# EasyEDA Pro project EasyEDAProject.epro

# Schematic Schematic1
Board Name: Board1; Create Date: 2025-12-03; Page Name: P1; Project Name: Tressure; Schematic Name: Schematic1; Update Date: 2025-12-18; Company: EasyEDA.com; Page Size: A4; Version: V1.0
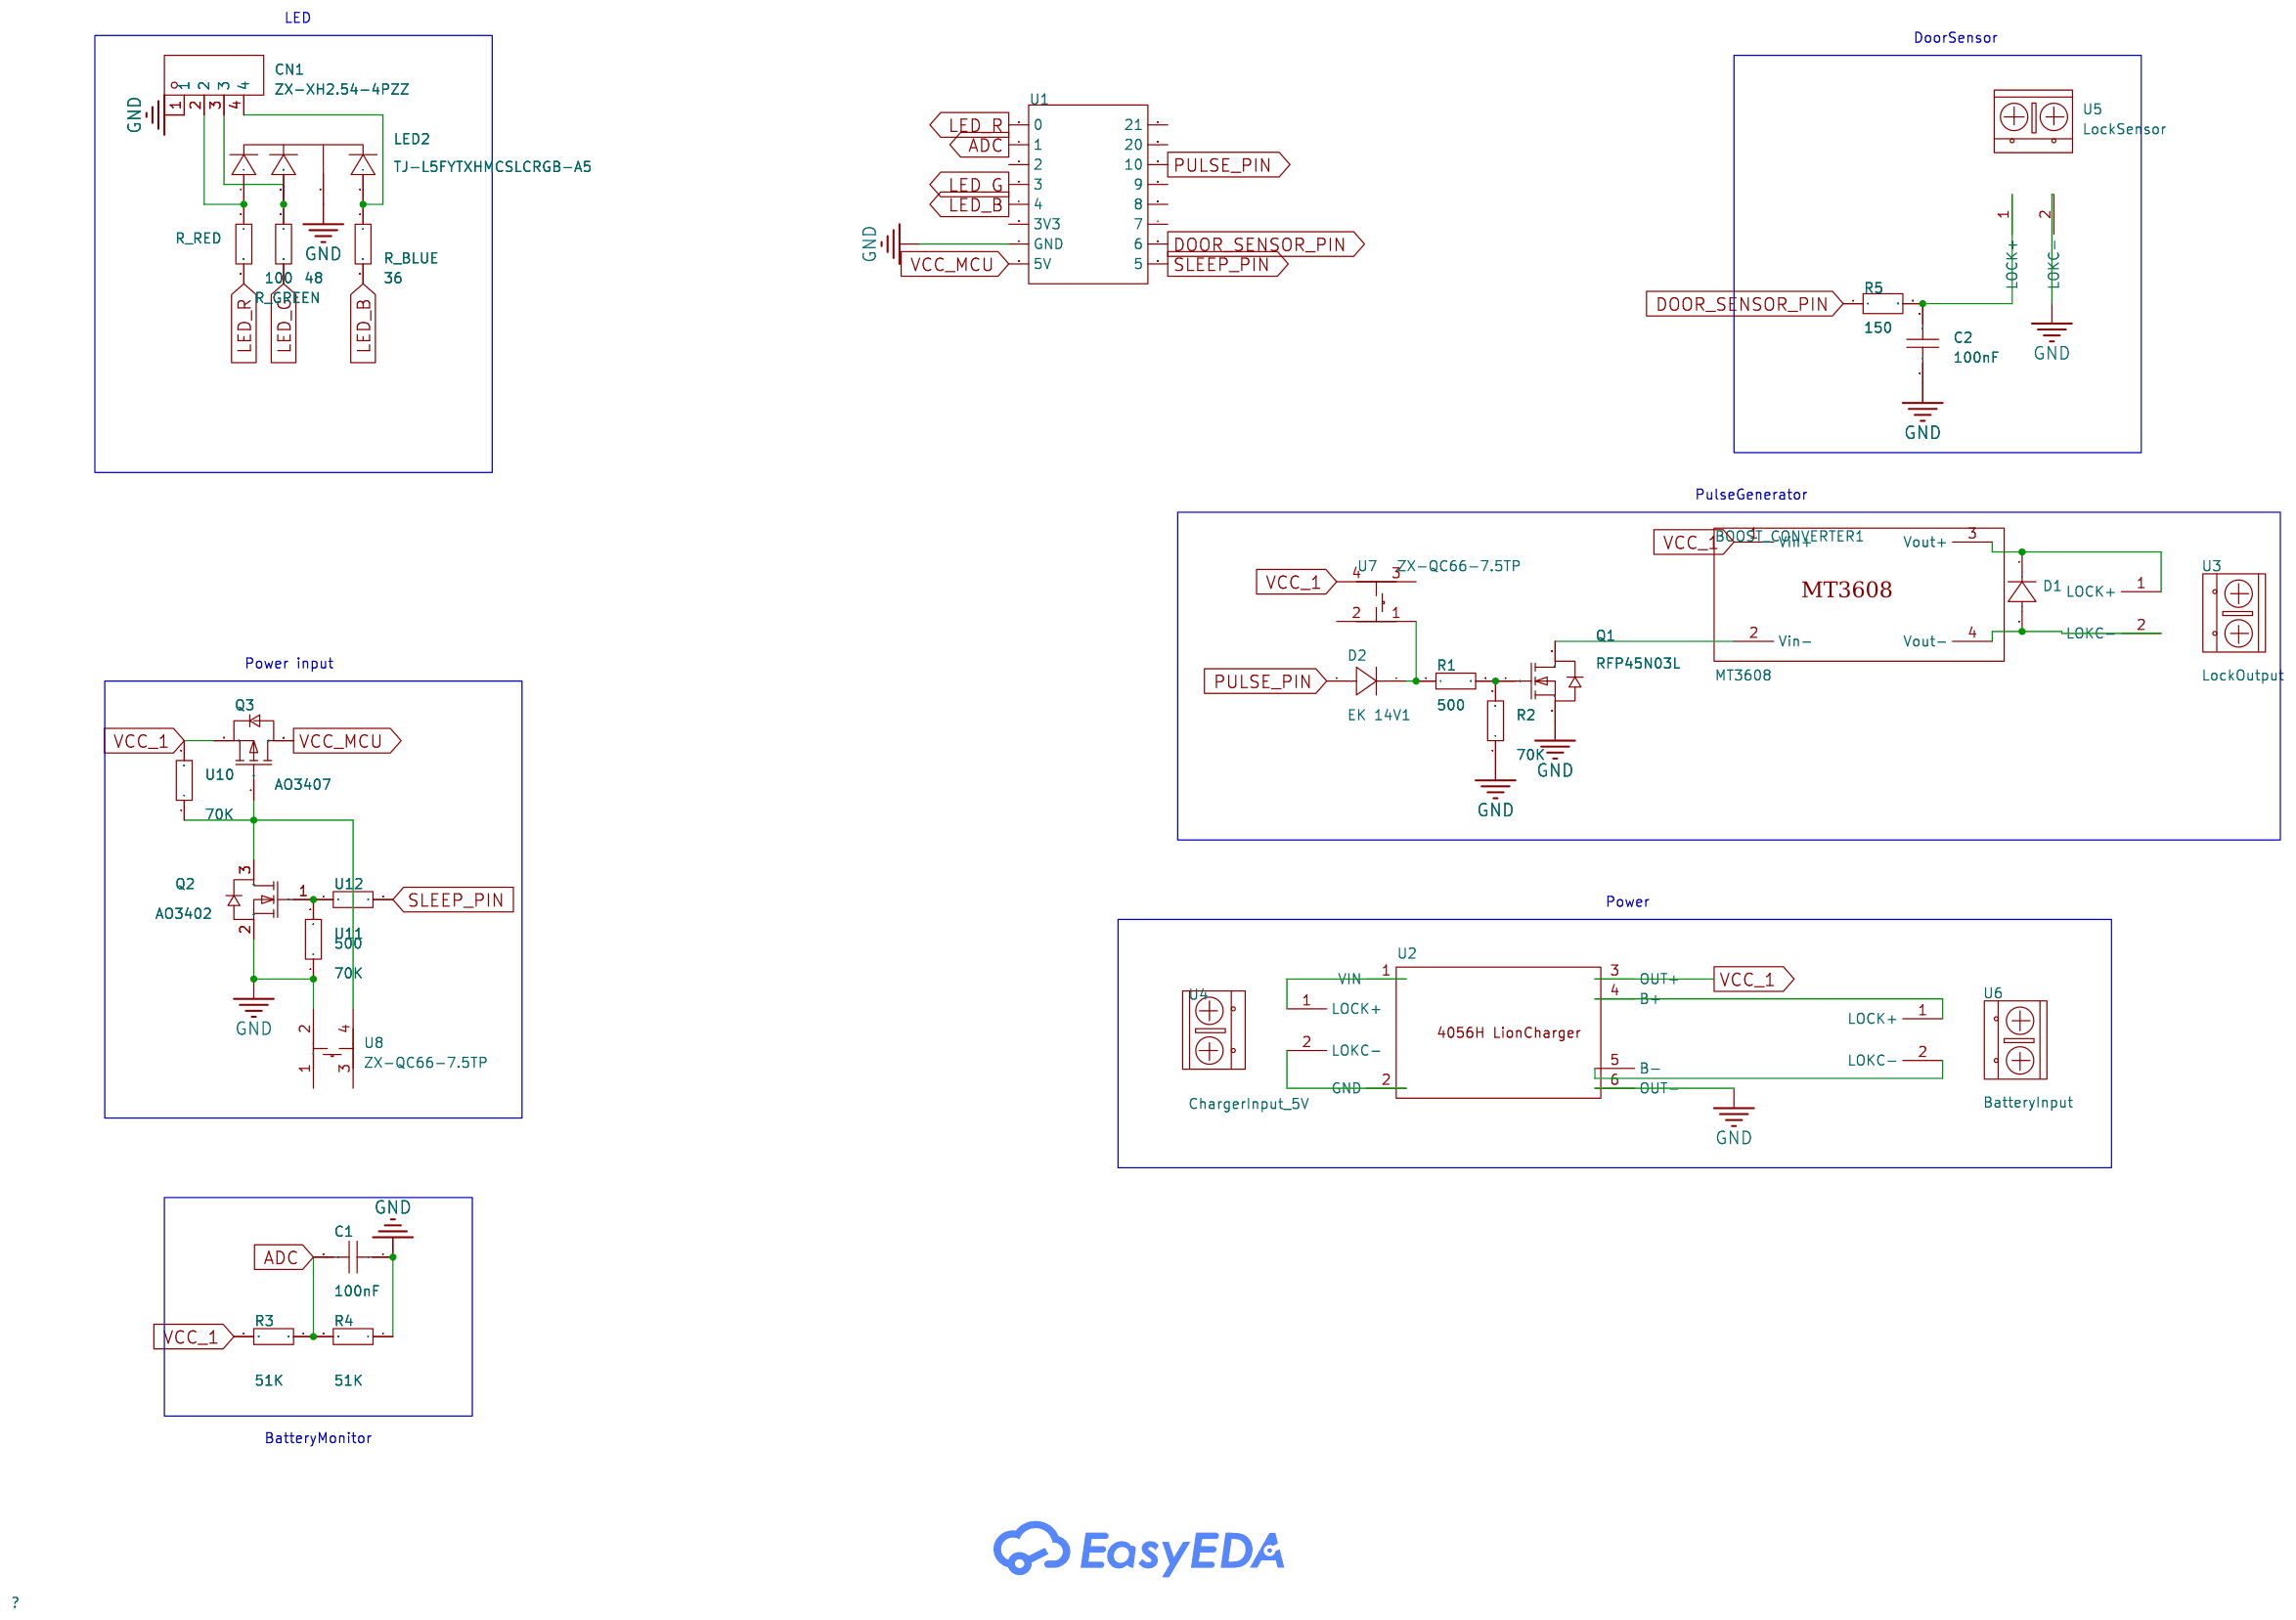
[diagram p0: schematic sheet]

## Parts
BOOST_CONVERTER1  MT3608  [MT3608 BOOST]
C1  100nF  [C0603]
C2  100nF  [CAP-TH_L5.0-W2.5-P5.00-D1.0]
CN1  ZX-XH2.54-4PZZ  [CONN-TH_4P-P2.50_4PIN]
D1  -  [SMA_L4.4-W2.8-LS5.4-RD]
D2  EK 14V1  [DIO-TH_BD2.7-L5.0-P10.00-D0.8]
LED2  TJ-L5FYTXHMCSLCRGB-A5  [LED-TH_4P-BD5.8-P1.30]
Q1  RFP45N03L  [TO-220-3_L9.9-W4.5-P2.54-L]
Q2  AO3402  [SOT-23_L2.9-W1.3-P1.90-LS2.4-BR]
Q3  AO3407  [SOT-23-3_L2.9-W1.3-P1.90-LS2.4-BR]
R1  500  [RES-TH_BD2.3-L6.5-P10.50-D0.5]
R2  70K  [RES-TH_BD2.3-L6.5-P10.50-D0.5]
R3  51K  [RES-TH_BD2.3-L6.5-P10.50-D0.5]
R4  51K  [RES-TH_BD2.3-L6.5-P10.50-D0.5]
R5  150  [RES-TH_BD2.3-L6.5-P10.50-D0.5]
R_BLUE  36  [RES-TH_BD2.3-L6.5-P10.50-D0.5]
R_GREEN  48  [RES-TH_BD2.3-L6.5-P10.50-D0.5]
R_RED  100  [RES-TH_BD2.3-L6.5-P10.50-D0.5]
U1  -  [ESP32-C3 SuperMini]
U2  -  [LionCharger]
U3  LockOutput  [TerminalBlock:TerminalBlock_bornier-2_P5.08mm]
U4  ChargerInput_5V  [TerminalBlock:TerminalBlock_bornier-2_P5.08mm]
U5  LockSensor  [TerminalBlock:TerminalBlock_bornier-2_P5.08mm]
U6  BatteryInput  [TerminalBlock:TerminalBlock_bornier-2_P5.08mm]
U7  ZX-QC66-7.5TP  [KEY-SMD_4P-L6.0-W6.0-P4.50-LS8.6]
U8  ZX-QC66-7.5TP  [KEY-SMD_4P-L6.0-W6.0-P4.50-LS8.6]
U10  70K  [RES-TH_BD2.3-L6.5-P10.50-D0.5]
U11  70K  [RES-TH_BD2.3-L6.5-P10.50-D0.5]
U12  500  [RES-TH_BD2.3-L6.5-P10.50-D0.5]

## Library data of the parts
BOOST_CONVERTER1 = MT3608
C1 = CAP_0603: Supplier Footprint: 0603
C2 = CC1H104MC1FD3F6C10MF: Capacitance:100nF Tolerance:±20% Tolerance:±20% Voltage Rating:50V Pin Spacing:5.08mm Temperature Coefficient:Y5V Diameter:6mm Body Thickness:2.2mm; LCSC Part Name: 100nF ±20% 50V; Supplier Part: C254085; Manufacturer: Dersonic(德尔创); Supplier Footprint: 插件,P=5.08mm; JLCPCB Part Class: Extended Part; Datasheet: https://item.szlcsc.com/datasheet/CC1H104MC1FD3F6C10MF/248635.html; Supplier: LCSC; Tolerance: ±20%; Voltage Rating: 50V; Pin Spacing: 5.08mm; Temperature Coefficient: Y5V; Diameter: 6mm; Body Thickness: 2.2mm
CN1 = ZX-XH2.54-4PZZ: Pins Structure:1x4P Pitch:2.5mm Mounting Type:Through Hole Reference Series:XH Number of Pins:4P Number of Rows:1 Number of PINs Per Row:4 Row Spacing:- Current Rating:3A Contact Material:Brass Contact Plating:Tin Operating Temperature:-25℃~+85℃ Operating; LCSC Part Name: 1x4P 间距:2.5mm 直插 系列:XH; Supplier Part: C7429634; Manufacturer: Megastar(兆星); Supplier Footprint: 插件,P=2.5mm; JLCPCB Part Class: Extended Part; Datasheet: https://item.szlcsc.com/datasheet/ZX-XH2.54-4PZZ/8427551.html; Supplier: LCSC; Pins Structure: 1x4P; Pitch: 2.5mm; Mounting Type: Through Hole; Reference Series: XH; Number of Pins: 4P; Number of Rows: 1; Number of PINs Per Row: 4; Current Rating: 3A; Contact Material: Brass; Contact Plating: Tin; Operating Temperature: -25℃~+85℃; Voltage Rating: 250V; Plastic Material: PA66; Flame Retardant Rating: UL94V-0; Color: White; Z-Height of the Board: 7mm; X-Length of Bottom Edge on Board (Spacing Line): 12.5mm; Y-Width of Bottom Edge on Board: 5.9mm
D1 = 1N4007: Supplier Footprint: SMA(DO-214AC); Supplier Part: C727081; JLCPCB Part Class: Extended Part
D2 = EK 14V1: Supplier Part: C19619582; Manufacturer: SANKEN(三垦); Supplier Footprint: 插件; JLCPCB Part Class: Extended Part; Datasheet: https://atta.szlcsc.com/upload/public/pdf/source/20231227/0C1AC18B852B4BA9064905ABC13E61C2.pdf; Supplier: LCSC
LED2 = TJ-L5FYTXHMCSLCRGB-A5: Diode Configuration:Common Cathode Luminous Intensity:R:100mcd~200mcd；B:100mcd~200mcd；G:800mcd~1200mcd Forward Voltage(Vf):R:1.8V~2.4V；B:2.8V~3.4V；G:2.8V~3.4V Operating Temperature:-20℃~+80℃ Operating Temperature:-20℃~+80℃; LCSC Part Name: RGB三色; Supplier Part: C330759; Manufacturer: TOGIALED(统佳); Supplier Footprint: 插件,D=5mm; JLCPCB Part Class: Extended Part; Datasheet: https://item.szlcsc.com/datasheet/TJ-L5FYTXHMCSLCRGB-A5/310372.html; Supplier: LCSC; Diode Configuration: Common Cathode; Luminous Intensity: R:100mcd~200mcd；B:100mcd~200mcd；G:800mcd~1200mcd; Forward Voltage(Vf): R:1.8V~2.4V；B:2.8V~3.4V；G:2.8V~3.4V; Operating Temperature: -20℃~+80℃
Q1 = RFP45N03L: Type:1 N-channel Drain Source Voltage (Vdss): Continuous Drain Current (Id):- Drain Source On Resistance (RDS(on)@Vgs,Id):22mΩ Power Dissipation (Pd): Gate Threshold Voltage (Vgs(th)@Id):2V@250uA Total Gate Charge (Qg@Vgs):60nC@10V Input Capacitance (Ciss; LCSC Part Name: 1个N沟道 耐压:30V 电流:45A; Supplier Part: C3290321; Manufacturer: HARRIS(哈利斯); Supplier Footprint: TO-220-3; JLCPCB Part Class: Extended Part; Datasheet: https://atta.szlcsc.com/upload/public/pdf/source/20240403/41EFF8D01A5A2EBD92568F0B79DD2BA2.pdf; Supplier: LCSC; Type: 1 N-channel; Drain Source On Resistance (RDS(on)@Vgs,Id): 22mΩ; Gate Threshold Voltage (Vgs(th)@Id): 2V@250uA; Total Gate Charge (Qg@Vgs): 60nC@10V; Input Capacitance (Ciss@Vds): 1.65nF@25V; Reverse Transfer Capacitance (Crss@Vds): 200pF@25V; Operating Temperature: -55℃~+175℃@(Tj)
Q2 = AO3402_C2938369: Number:1 N-Channel Drain to Source Voltage:30V Current - Continuous Drain(Id):4A RDS(on):55mΩ@10V Pd - Power Dissipation:1.2W Gate Threshold Voltage (Vgs(th)):1.4V@250uA Gate Charge(Qg):4.34nC@4.5V Input Capacitance(Ciss):390pF Reverse Transfer Capacitanc; LCSC Part Name: 1个N沟道 耐压:30V 电流:4A; Supplier Part: C2938369; Manufacturer: GOODWORK(固得沃克); Supplier Footprint: SOT-23; JLCPCB Part Class: Extended Part; Datasheet: https://item.szlcsc.com/datasheet/AO3402/3294706.html; Supplier: LCSC; Number: 1 N-Channel; Drain to Source Voltage: 30V; Current - Continuous Drain(Id): 4A; RDS(on): 55mΩ@10V; Pd - Power Dissipation: 1.2W; Gate Threshold Voltage (Vgs(th)): 1.4V@250uA; Gate Charge(Qg): 4.34nC@4.5V; Input Capacitance(Ciss): 390pF; Reverse Transfer Capacitance (Crss@Vds): 41pF; Operating Temperature: -55℃~+150℃; Type: N-Channel; Output Capacitance(Coss): 54.5pF
Q3 = AO3407_C6562206: Number:1 P-Channel Drain to Source Voltage:30V Current - Continuous Drain(Id):3.5A RDS(on):87mΩ@4.5V Pd - Power Dissipation:350mW Gate Threshold Voltage (Vgs(th)):1.5V Gate Charge(Qg):- Input Capacitance(Ciss):565pF@0V Reverse Transfer Capacitance (Crss@V; LCSC Part Name: P沟道增强型MOSFET 1个P沟道 耐压:30V 电流:3.5A; Supplier Part: C6562206; Manufacturer: YONGYUTAI(永裕泰); Supplier Footprint: SOT-23; JLCPCB Part Class: Extended Part; Datasheet: https://item.szlcsc.com/datasheet/AO3407/7516174.html; Supplier: LCSC; Number: 1 P-Channel; Drain to Source Voltage: 30V; Current - Continuous Drain(Id): 3.5A; RDS(on): 87mΩ@4.5V; Pd - Power Dissipation: 350mW; Gate Threshold Voltage (Vgs(th)): 1.5V; Input Capacitance(Ciss): 565pF@0V; Reverse Transfer Capacitance (Crss@Vds): 77pF; Operating Temperature: -55℃~+150℃; Type: P-Channel; Output Capacitance(Coss): 89pF
R1-R4 R_BLUE R_GREEN R_RED U10-U12 = Res_0603: Supplier Footprint: 0603
R5 = MF1/4W-1KΩ±1%T52: Type:Metal Film Resistors Resistance: Tolerance:±1% Tolerance:±1% Power(Watts):250mW Temperature Coefficient:±200ppm/℃ Temperature Coefficient:±200ppm/℃; LCSC Part Name: 金属膜电阻 1kΩ ±1% 250mW; Supplier Part: C713997; Manufacturer: 华星机电; Supplier Footprint: 插件,D2.3xL6.5mm; JLCPCB Part Class: Extended Part; Datasheet: https://atta.szlcsc.com/upload/public/pdf/source/20200731/C713882_AE8EB1102749D7E4FB4FB13DC898C429.pdf; Supplier: LCSC; Type: Metal Film Resistors; Tolerance: ±1%; Power(Watts): 250mW; Temperature Coefficient: ±200ppm/℃
U1 = ESP32-C3 SuperMini
U2 = Lio-Charger
U3-U6 = TerminalBlock:TerminalBlock_bornier-2_P5.08mm
U7 U8 = ZX-QC66-7.5TP: Circuit:SPST Actuator Style:Round Button Operating Force:2.6N Mounting Type:Surface Mount,Vertical Length:6mm Width:6mm Switch Height:7.5mm with Bracket:Without Bracket Contact Current:50mA Voltage Rating:12V Actuator/Cap Color:Black Termination Style:Gul; LCSC Part Name: 6*6*7.5贴片; Supplier Part: C7470157; Manufacturer: Megastar(兆星); Supplier Footprint: SMD-4P,6x6mm; JLCPCB Part Class: Extended Part; Datasheet: https://item.szlcsc.com/datasheet/ZX-QC66-7.5TP/8519163.html; Supplier: LCSC; Circuit: SPST; Actuator Style: Round Button; Operating Force: 2.6N; Mounting Type: Surface Mount,Vertical; Length: 6mm; Width: 6mm; Switch Height: 7.5mm; with Bracket: Without Bracket; Contact Current: 50mA; Voltage Rating: 12V; Actuator/Cap Color: Black; Termination Style: Gull Wing; Life: 100,000 Cycles; Operating Temperature: -30℃~+80℃

## Nets
GND: C1.1 C2.1 CN1.1 LED2.2(-) Q1.3(S) Q2.2(S) R2.1 R4.1 U1.14(GND) U2.6(OUT-) U5.2(LOKC-) U8.2 U11.1
VCC_1: BOOST_CONVERTER1.1(Vin+) Q3.2(S) R3.2 U2.3(OUT+) U7.4 U10.2
VCC_MCU: Q3.3(D) U1.15(5V)
ADC: C1.2 R3.1 R4.2 U1.1
DOOR_SENSOR_PIN: R5.1 U1.6
LED_B: R_BLUE.2 U1.4
LED_G: R_GREEN.2 U1.3
LED_R: R_RED.2 U1.0
PULSE_PIN: D2.2(A) U1.10
SLEEP_PIN: U1.5 U12.2
$1N1444: BOOST_CONVERTER1.3(Vout+) D1.1(K) U3.1(LOCK+)
$1N1449: BOOST_CONVERTER1.4(Vout-) D1.2(A) U3.2(LOKC-)
$1N1690: Q1.1(G) R1.2 R2.2
$1N2096: U2.1(VIN) U4.1(LOCK+)
$1N2102: U2.2(GND) U4.2(LOKC-)
$1N2853: CN1.2 LED2.4 R_RED.1
$1N2860: CN1.3 LED2.3 R_GREEN.1
$1N3330: CN1.4 LED2.1 R_BLUE.1
$1N3406: U2.5(B-) U6.2(LOKC-)
$1N3411: U2.4(B+) U6.1(LOCK+)
$1N4634: Q2.3(D) Q3.1(G) U8.4 U10.1
$1N4694: Q2.1(G) U11.2 U12.1
$1N5103: C2.2 R5.2 U5.1(LOCK+)
$1N6881: BOOST_CONVERTER1.2(Vin-) Q1.2(D)
$1N6917: D2.1(K) R1.1 U7.1

Not connected (* = marked no-connect by the designer): U1 2 7 8 9 13(3V3) 20 21; U7 2 3; U8 1 3

## Notes on the sheet
- LED
- DoorSensor
- PulseGenerator
- Power input
- Power
- BatteryMonitor

# Board PCB1
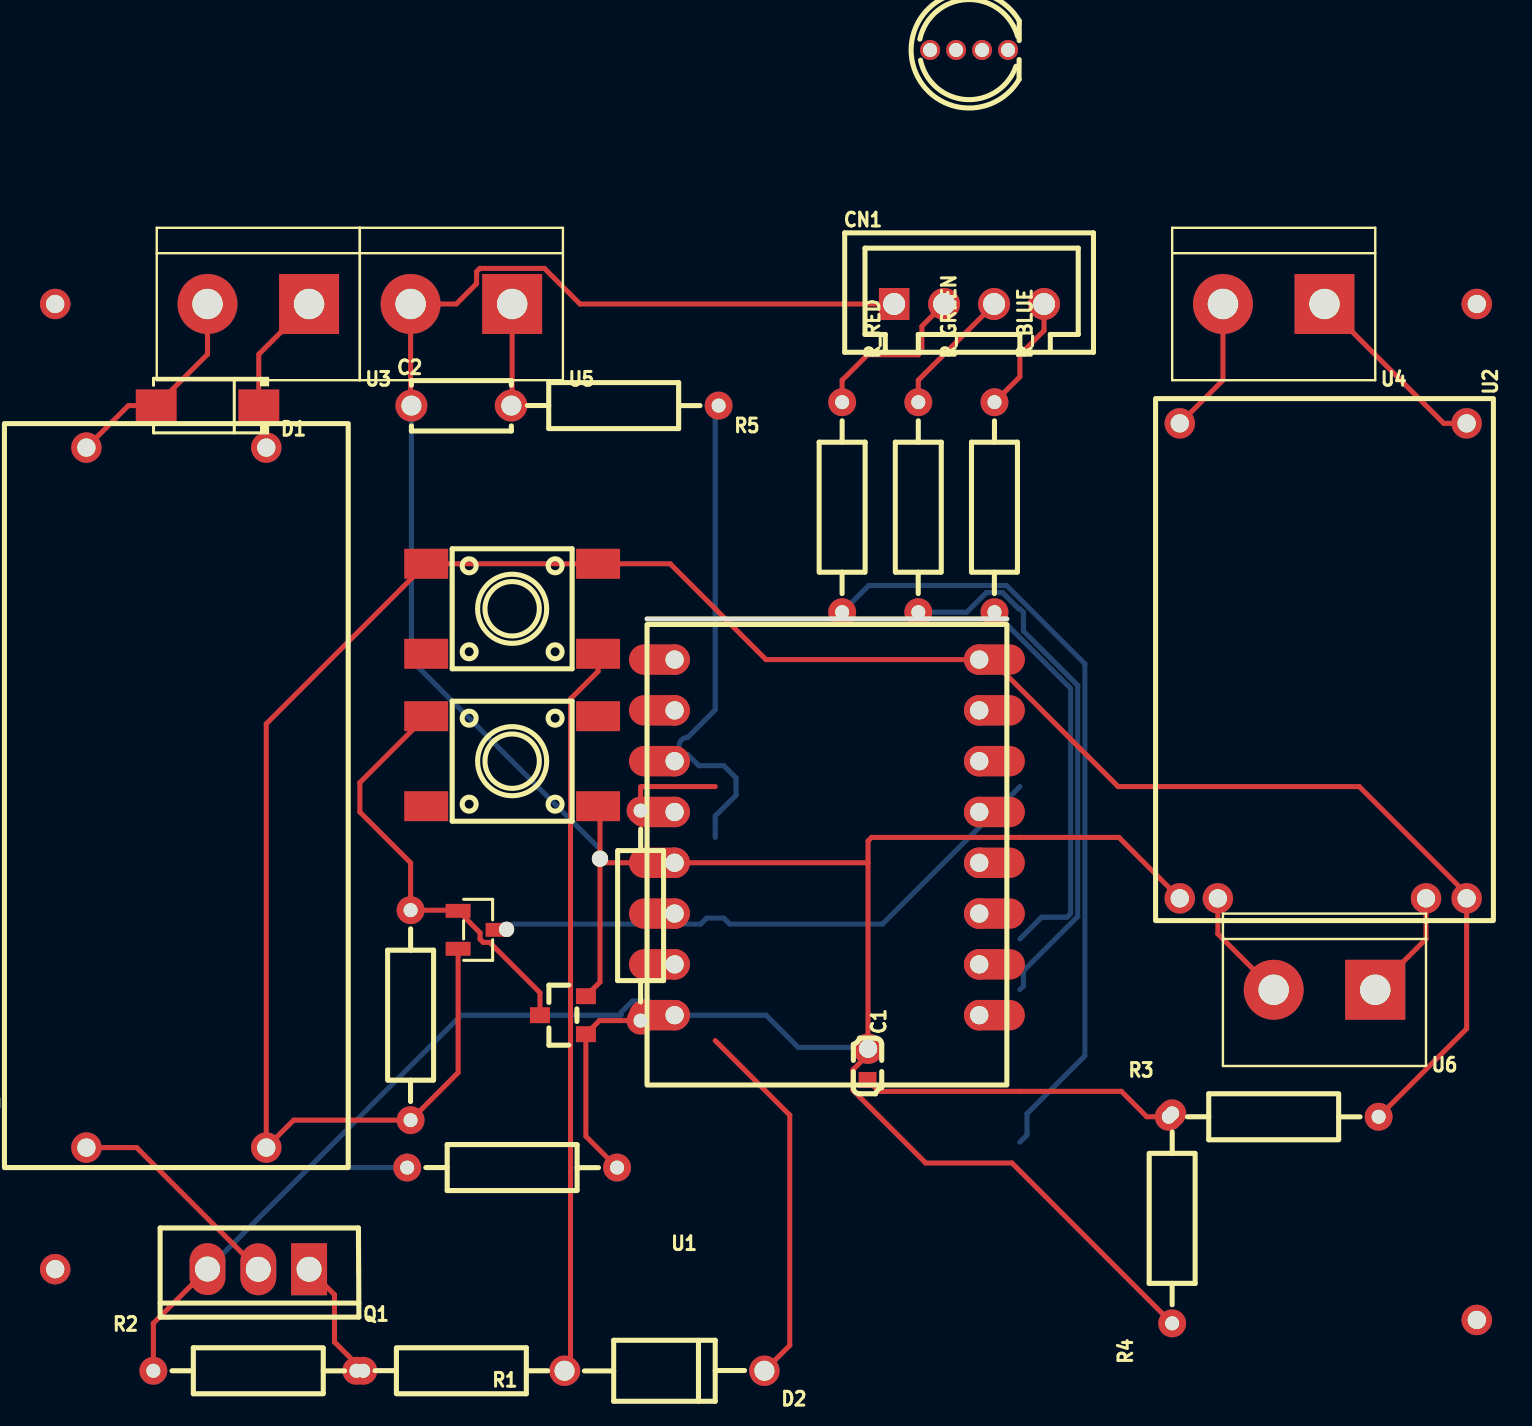
[diagram p1: board, top side]
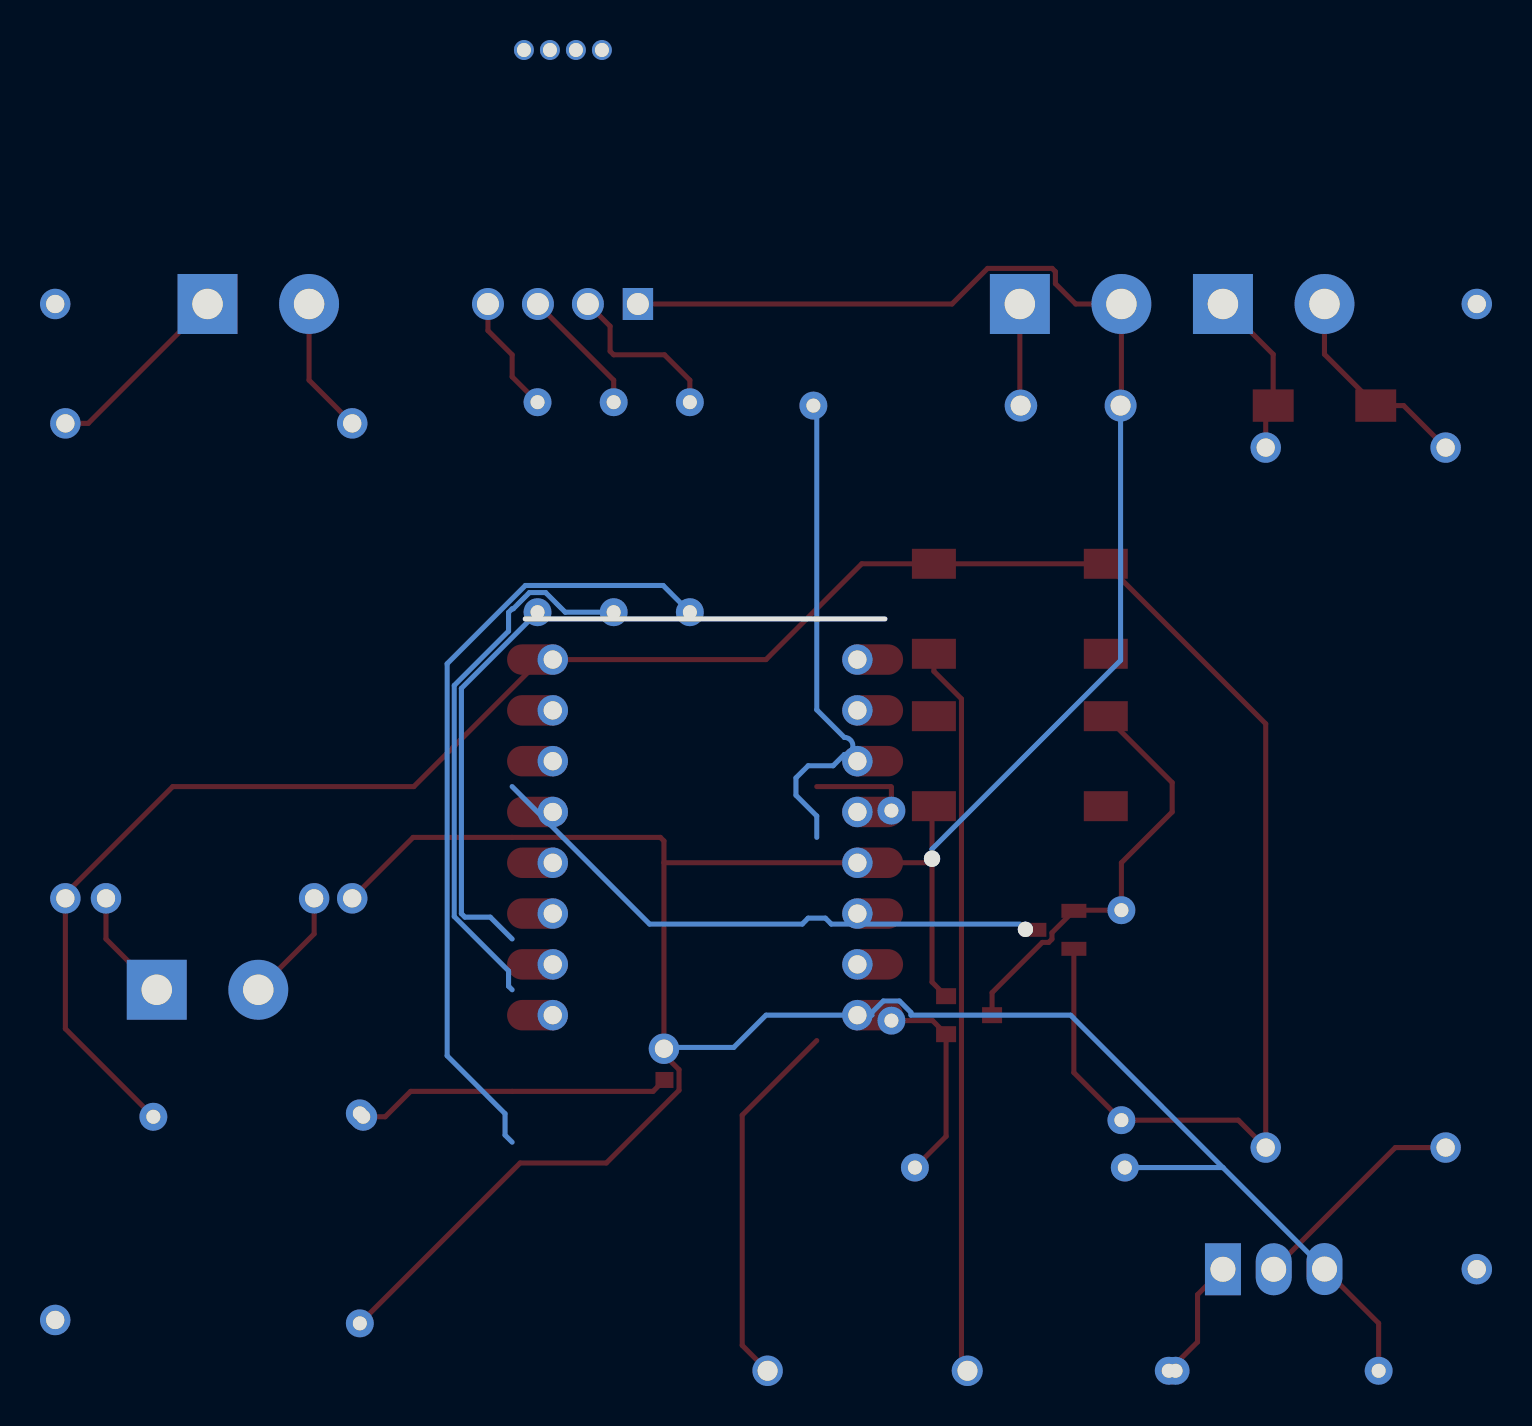
[diagram p2: board, bottom side, seen from below]

Outline 18 x 0 mm; copper layers: Top Layer, Bottom Layer. Coordinates in mm from the lower left corner of the outline.
Stack: Top Layer 0.035mm / Dielectric1 1.51mm FR4 er 4.5 / Bottom Layer 0.035mm

## Design rules (mm)
template: JLCPCB Capability(Two Layers Board)
spacing copperThickness1oz (default): track to track 0.102, other pairs 0.152 to 0.3
spacing copperThickness2oz: track to track 0.203, other pairs 0.152 to 0.3
track width copperThickness1oz (default): min 0.127, default 0.254, max 2.54
track width copperThickness2oz: min 0.203, default 0.254, max 2.54
differential pair differentialPair (default): width min 0.127, default 0.254, max 2.54; gap min 0.152, default 0.152
via viaSize (default): diameter min 0.5, default 0.61, max 10; hole min 0.3, default 0.305, max 6.3

## Placement (name value [footprint] x y rotation side)
BOOST_CONVERTER1  MT3608  [MT3608 BOOST]  -32.15 -27.43 90 top
C1  100nF  [C0603]  11.03 -22.35 270 top
C2  100nF  [CAP-TH_L5.0-W2.5-P5.00-D1.0]  -9.29 10.67 0 top
CN1  ZX-XH2.54-4PZZ  [CONN-TH_4P-P2.50_4PIN]  16.11 15.75 0 top
D1  -  [SMA_L4.4-W2.8-LS5.4-RD]  -21.99 10.67 180 top
D2  EK 14V1  [DIO-TH_BD2.7-L5.0-P10.00-D0.8]  0.87 -37.59 180 top
LED2  TJ-L5FYTXHMCSLCRGB-A5  [LED-TH_4P-BD5.8-P1.30]  16.11 28.45 0 top
NOREF  -  [Pad_e23]  -29.61 -32.51 0 top
NOREF#2  -  [Pad_e22]  41.51 -35.05 0 top
NOREF#3  -  [Pad_e25]  -29.61 15.75 0 top
NOREF#4  -  [Pad_e24]  41.51 15.75 0 top
NOREF#5  -  [Pad_e320]  -2.35 -11.99 0 top
NOREF#6  -  [Pad_e131]  11.06 -21.49 0 top
NOREF#7  -  [Pad_e360]  -7.03 -15.52 0 top
Q1  RFP45N03L  [TO-220-3_L9.9-W4.5-P2.54-L]  -19.45 -32.51 180 top
Q2  AO3402  [SOT-23_L2.9-W1.3-P1.90-LS2.4-BR]  -4.21 -19.81 0 top
Q3  AO3407  [SOT-23-3_L2.9-W1.3-P1.90-LS2.4-BR]  -8.45 -15.55 180 top
R1  500  [RES-TH_BD2.3-L6.5-P10.50-D0.5]  -9.29 -37.59 180 top
R2  70K  [RES-TH_BD2.3-L6.5-P10.50-D0.5]  -19.45 -37.59 0 top
R3  51K  [RES-TH_BD2.3-L6.5-P10.50-D0.5]  31.35 -24.89 0 top
R4  51K  [RES-TH_BD2.3-L6.5-P10.50-D0.5]  26.27 -29.97 90 top
R5  150  [RES-TH_BD2.3-L6.5-P10.50-D0.5]  -1.67 10.67 180 top
R_BLUE  36  [RES-TH_BD2.3-L6.5-P10.50-D0.5]  17.38 5.59 270 top
R_GREEN  48  [RES-TH_BD2.3-L6.5-P10.50-D0.5]  13.57 5.59 270 top
R_RED  100  [RES-TH_BD2.3-L6.5-P10.50-D0.5]  9.76 5.59 270 top
U1  -  [ESP32-C3 SuperMini]  11.03 -17.27 0 top
U2  -  [LionCharger]  33.89 -2.03 270 top
U3  LockOutput  [TerminalBlock:TerminalBlock_bornier-2_P5.08mm]  -16.91 15.75 180 top
U4  ChargerInput_5V  [TerminalBlock:TerminalBlock_bornier-2_P5.08mm]  33.89 15.75 180 top
U5  LockSensor  [TerminalBlock:TerminalBlock_bornier-2_P5.08mm]  -6.75 15.75 180 top
U6  BatteryInput  [TerminalBlock:TerminalBlock_bornier-2_P5.08mm]  36.43 -18.54 180 top
U7  ZX-QC66-7.5TP  [KEY-SMD_4P-L6.0-W6.0-P4.50-LS8.6]  -6.75 0.51 180 top
U8  ZX-QC66-7.5TP  [KEY-SMD_4P-L6.0-W6.0-P4.50-LS8.6]  -6.75 -7.11 180 top
U10  70K  [RES-TH_BD2.3-L6.5-P10.50-D0.5]  -11.83 -19.81 270 top
U11  70K  [RES-TH_BD2.3-L6.5-P10.50-D0.5]  -6.75 -27.43 0 top
U12  500  [RES-TH_BD2.3-L6.5-P10.50-D0.5]  -0.32 -14.83 90 top

## Footprints (pads in the part's own frame, mm; a bottom-side part is the same pattern mirrored in y, then rotated)
C0603
  rect 0.8x0.9 smd: 1(-0.7,0) 2(0.7,0)
CAP-TH_L5.0-W2.5-P5.00-D1.0
  round 1.6 hole 1: 1(-2.5,0) 2(2.5,0)
CONN-TH_4P-P2.50_4PIN
  rect 1.524x1.6 hole 1.1: 1(-3.75,0)
  round 1.6 hole 1.1: 2(-1.25,0) 3(1.25,0) 4(3.75,0)
DIO-TH_BD2.7-L5.0-P10.00-D0.8
  round 1.524 hole 1: 1(5,0) 2(-5,0)
ESP32-C3 SuperMini
  round 1.524 hole 0.914: 0(5.588,-2.54) 1(5.588,0) 2(5.588,2.54) 3(5.588,5.08) 4(5.588,7.62) 5(-9.652,15.24) 6(-9.652,12.7) 7(-9.652,10.16) 8(-9.652,7.62) 9(-9.652,5.08) 10(-9.652,2.54) 13(5.588,10.16) 14(5.588,12.7) 15(5.588,15.24) 20(-9.652,0) 21(-9.652,-2.54)
  oval 3.048x1.524 smd: 0(6.35,-2.54) 1(6.35,0) 2(6.35,2.54) 3(6.35,5.08) 4(6.35,7.62) 5(-10.414,15.24) 6(-10.414,12.7) 7(-10.414,10.16) 8(-10.414,7.62) 9(-10.414,5.08) 10(-10.414,2.54) 13(6.35,10.16) 14(6.35,12.7) 15(6.35,15.24) 20(-10.414,0) 21(-10.414,-2.54)
KEY-SMD_4P-L6.0-W6.0-P4.50-LS8.6
  rect 2.2x1.5 smd: 1(-4.3,2.25) 2(4.3,2.25) 3(-4.3,-2.25) 4(4.3,-2.25)
LED-TH_4P-BD5.8-P1.30
  round 1 hole 0.7: 1(1.95,0) 2(0.65,0) 3(-0.65,0) 4(-1.95,0)
LionCharger
  round 1.524 hole 0.914: 1(-11.811,7.112) 2(-11.811,-7.239) 3(11.938,7.112) 4(11.938,5.08) 5(11.938,-5.334) 6(11.938,-7.239)
MT3608 BOOST
  round 1.524 hole 0.914: 1(1,-13.1) 2(1,-4.1) 3(36,-13.1) 4(36,-4.1)
Pad_e22
  round 1.524 hole 0.914: 1(0,0)
Pad_e23
  round 1.524 hole 0.914: 2(0,0)
Pad_e24
  round 1.524 hole 0.914: 3(0,0)
Pad_e25
  round 1.524 hole 0.914: 4(0,0)
Pad_e131
  round 1.524 hole 0.914: 1(0,0)
Pad_e320
  round 0.813 hole 1.32x0.508: 1(0,0)
Pad_e360
  round 0.762 hole 1.32x0.254: 1(0,0)
RES-TH_BD2.3-L6.5-P10.50-D0.5
  round 1.4 hole 0.7: 1(-5.25,0) 2(5.25,0)
SMA_L4.4-W2.8-LS5.4-RD
  rect 2.046x1.62 smd: 1(-2.566,0) 2(2.566,0)
SOT-23-3_L2.9-W1.3-P1.90-LS2.4-BR
  rect 1.25x0.7 smd: 1(1,-0.95) 2(1,0.95) 3(-1,0)
SOT-23_L2.9-W1.3-P1.90-LS2.4-BR
  rect 1x0.8 smd: 1(1.15,-0.95) 2(1.15,0.95) 3(-1.15,0)
TerminalBlock:TerminalBlock_bornier-2_P5.08mm
  rect 3x3 hole 1.52: 1(0,0)
  round 3 hole 1.52: 2(5.08,0)
TO-220-3_L9.9-W4.5-P2.54-L
  rect 1.8x2.6 hole 1.25: 1(-2.54,0.005)
  oval 1.8x2.6 hole 1.25: 2(0,0.005) 3(2.54,-0.005)

## Nets
As in the schematic, except:
GND: C1.1 C2.1 CN1.1 LED2.2 NOREF#5.1 NOREF#6.1 Q1.3 Q2.2 R2.1 R4.1 U1.14 U2.6 U5.2 U8.1 U11.1
VCC_1: BOOST_CONVERTER1.1 Q3.2 R3.2 U2.3 U7.3 U7.4 U10.2
VCC_MCU: NOREF#7.1 Q3.3 U1.15

Pads without a net: NOREF 2; NOREF#2 1; NOREF#3 4; NOREF#4 3; U1 2 7 8 9 13 20 21; U7 2; U8 2 3

## Routing (per net, layer and track width the routed paths; a pad name or vN(x,y) marks a point on that pad's centre or on a via; arc(x,y) is an arc through that point)
GND: length 182.3
  Top Layer w0.254: NOREF#5.1 -2.35,-9.46 U8.1 ; R2.1 -24.7,-35.22 Q1.3 ; U2.6 23.61,-10.92 11.24,-10.92 11.06,-11.1 11.06,-12.19 ; Q2.2 -2.35,-18.16 -2.35,-12 -2.16,-12.19 11.06,-12.19 ; R4.1 18.25,-27.2 13.94,-27.2 10.3,-23.57 10.3,-22.54 11.06,-21.78 NOREF#6.1 11.06,-12.19 ; C2.1 -11.83,10.71 U5.2 -9.54,15.75 -8.53,16.76 -8.53,17.36 -8.36,17.53 -5.13,17.53 -3.35,15.75 CN1.1
  Bottom Layer w0.254: C2.1 -11.79,-2.07 -2.35,-11.51 NOREF#5.1 ; -16.91,-27.43 -21.98,-32.51 Q1.3 ; -16.91,-27.43 U11.1 ; -16.91,-27.43 -9.29,-19.81 -1.3,-19.81 -1.3,-19.68 -0.73,-19.1 0.08,-19.1 0.66,-19.68 0.66,-19.81 5.95,-19.81 7.56,-21.42 11.06,-21.42
VCC_1: length 121.7
  Top Layer w0.254: Q3.2 -9.45,-22.68 U10.2 -17.68,-25.06 BOOST_CONVERTER1.1 -19.05,-5.24 U7.4 U7.3 1.16,2.76 5.95,-2.03 17.22,-2.03 23.57,-8.38 35.63,-8.38 41,-13.75 41,-20.49 R3.2
VCC_MCU: length 28.5
  Bottom Layer w0.254: -6.75,-15.26 2.69,-15.26 2.98,-14.96 3.84,-14.96 4.14,-15.26 11.78,-15.26 18.65,-8.38
ADC: length 15.8
  Top Layer w0.254: C1.2 11.6,-23.62 23.73,-23.62 25,-24.89 R3.1
DOOR_SENSOR_PIN: length 24.9
  Bottom Layer w0.254: R5.1 3.41,10.5 3.41,-4.54 2.03,-5.92 arc(1.61,-6.35) 2.03,-6.78 2.6,-7.34 3.84,-7.34 4.45,-7.95 4.45,-8.81 3.41,-9.85 3.41,-10.92
LED_B: length 19.7
  Bottom Layer w0.254: R_BLUE.2 21.19,-3.47 21.19,-14.73 21.01,-14.91 19.74,-14.91 18.65,-16
LED_G: length 27.3
  Bottom Layer w0.254: 18.65,-18.54 18.83,-18.36 18.83,-17.6 21.55,-14.88 21.55,-3.32 18.83,-0.61 18.83,0.33 18.65,0.51 18.6,0.51 17.79,1.32 16.98,1.32 16,0.34 R_GREEN.2
LED_R: length 39.6
  Bottom Layer w0.254: R_RED.2 11.1,1.67 17.99,1.67 21.9,-2.24 21.9,-21.84 19.01,-24.74 19.01,-25.81 18.65,-26.16
PULSE_PIN: length 18.6
  Top Layer w0.254: 3.41,-21.08 7.14,-24.81 7.14,-36.32 D2.2
SLEEP_PIN: length 4.9
  Top Layer w0.254: 3.41,-8.38 -0.29,-8.38 -0.32,-8.41 U12.2
$1N1444: length 8.4
  Top Layer w0.254: BOOST_CONVERTER1.3 -19.05,10.29 D1.1 -19.42,13.23 U3.1
$1N1449: length 10.5
  Top Layer w0.254: BOOST_CONVERTER1.4 -25.95,10.67 D1.2 -21.99,13.23 U3.2
$1N1690: length 6.2
  Top Layer w0.254: R2.2 -15.64,-36.15 -15.64,-33.79 Q1.1
$1N2096: length 9.6
  Top Layer w0.254: U4.1 39.86,9.78 41,9.78
$1N2102: length 6.9
  Top Layer w0.254: U4.2 28.81,11.94 26.65,9.78
$1N2853: length 8.5
  Top Layer w0.254: CN1.2 13.75,14.64 13.75,13.39 13.57,13.21 11.03,13.21 9.76,11.94 R_RED.1
$1N2860: length 6.5
  Top Layer w0.254: CN1.3 17.36,15.73 13.57,11.94 R_GREEN.1
$1N3330: length 5.9
  Top Layer w0.254: R_BLUE.1 18.65,12.11 18.65,13.21 19.86,14.42 CN1.4
$1N3406: length 5.7
  Top Layer w0.254: U2.5 28.56,-15.75 U6.2
$1N3411: length 5.6
  Top Layer w0.254: U6.1 38.97,-16 U2.4
$1N4634: length 21.6
  Top Layer w0.254: U8.4 -14.37,-8.18 -14.37,-9.65 -11.83,-12.19 U10.1 -9.48,-14.56 Q3.1 -8.35,-15.69 -8.35,-16.01 -8.19,-16.17 -7.87,-16.17 -5.36,-18.69 Q2.3
$1N4694: length 10.3
  Top Layer w0.254: U11.2 -3.06,-25.87 Q2.1 -2.38,-20.08 U12.1
$1N5103: length 5.1
  Top Layer w0.254: C2.2 -6.75,10.71 U5.1
$1N6881: length 11.1
  Top Layer w0.254: BOOST_CONVERTER1.2 -25.53,-26.43 Q1.2
$1N6917: length 36.5
  Top Layer w0.254: D2.1 -3.83,-37.29 -3.83,-4 -2.45,-2.62 U7.1
